# Altium schematic sheet XCF08PFS48C_FLASH.SchDoc: FPGA Config XCF08PFS48C
size A4; Organization: Altium Limited.; Address1: Level 3, 12a Rodborough Rd; Address2: Frenchs Forest 2086; Address3: NSW; Address4: AUSTRALIA; SheetNumber: 1; SheetTotal: 100; PageSetup: Record=PageOptions|CenterHorizontal=True|CenterVertical=True|PrintScale=0.75|XCorrection=1.00|YCorrection=1.00|PrintKind=0|BorderSize=5000000|LeftOffset=0|BottomOffset=0|Orientation=2|PaperLength=1000|PaperWidth=1000|Scale=100|PaperSource=7|PrintQuality=-4|MediaType=1|DitherType=10|PaperKind=A4 (210 x 297mm)|PrintScaleMode=1
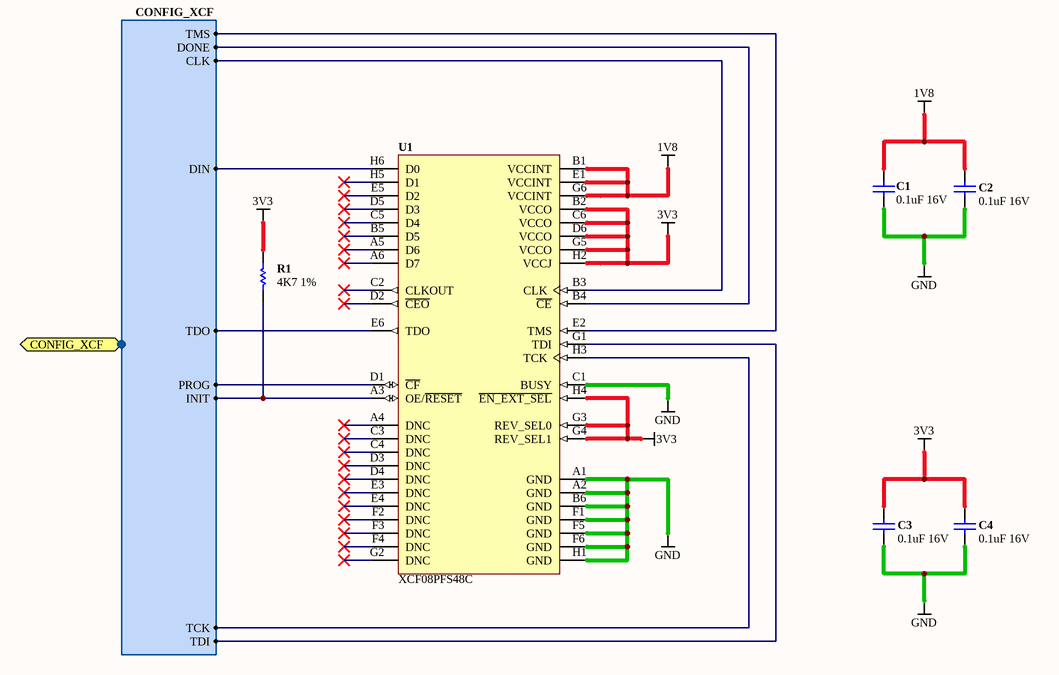
[diagram p0: XCF08PFS48C_FLASH.SchDoc]

## Parts
C1  0.1uF 16V  [CAPC1005-STAR]
C2  0.1uF 16V  [CAPC1005-STAR]
C3  0.1uF 16V  [CAPC1005-STAR]
C4  0.1uF 16V  [CAPC1005-STAR]
R1  4K7 1%  [RESC1005-STAR]
U1  XCF08PFS48C  [BGA80P8X6-48]

## Ports
CONFIG_XCF (harness CONFIG_XCF)

## Harnesses
CONFIG_XCF: DONE, CLK, TMS, DIN, TDO, PROG, INIT, TCK, TDI

## Nets
1V8: C1.2 C2.1 U1.B1(VCCINT) U1.E1(VCCINT) U1.G6(VCCINT)
3V3: C3.1 C4.1 R1.1 U1.B2(VCCO) U1.C6(VCCO) U1.D6(VCCO) U1.G3(REV_SEL0) U1.G4(REV_SEL1) U1.G5(VCCO) U1.H2(VCCJ) U1.H4(~{EN_EXT_SEL})
GND: C1.1 C2.2 C3.2 C4.2 U1.A1(GND) U1.A2(GND) U1.B6(GND) U1.C1(BUSY) U1.F1(GND) U1.F5(GND) U1.F6(GND) U1.H1(GND)
NetR1_2: R1.2 U1.A3(OE/~{RESET}) ; port CONFIG_XCF.INIT
NetU1_B3: U1.B3(CLK) ; port CONFIG_XCF.CLK
NetU1_B4: U1.B4(~{CE}) ; port CONFIG_XCF.DONE
NetU1_D1: U1.D1(~{CF}) ; port CONFIG_XCF.PROG
NetU1_E2: U1.E2(TMS) ; port CONFIG_XCF.TMS
NetU1_E6: U1.E6(TDO) ; port CONFIG_XCF.TDO
NetU1_G1: U1.G1(TDI) ; port CONFIG_XCF.TDI
NetU1_H3: U1.H3(TCK) ; port CONFIG_XCF.TCK
NetU1_H6: U1.H6(D0) ; port CONFIG_XCF.DIN

Not connected (* = marked no-connect by the designer): U1 A4(DNC)* A5(D6)* A6(D7)* B5(D5)* C2(CLKOUT)* C3(DNC)* C4(DNC)* C5(D4)* D2(~{CEO})* D3(DNC)* D4(DNC)* D5(D3)* E3(DNC)* E4(DNC)* E5(D2)* F2(DNC)* F3(DNC)* F4(DNC)* G2(DNC)* H5(D1)*

## Notes on the sheet
- Sheet Title
- Project Title
- Size:
- Date:
- A4
- Assy:
- Time:
- Revision:
- Sheet
- of
- File:

## Library data of the parts
C1-C4 = D-101-0080: Capacitor, Ceramic, 0.1uF 10% 16V 0402 (1005) X7R; Polarity: Non-Polarized; Category: Capacitor; Capacitance: 0.1 uF; Dielectric: X7R; Mounting Technology: Surface Mount; Rated Voltage: 16 V; Status: Production; Technology: Ceramic; Tolerance: 10 %
R1 = D-100-0088: Resistor, 4K7 1% 0402 (1005); Power Rating: 63 mW; Resistance: 4.7 K; Category: Resistor; Mounting Technology: Surface Mount; Status: Production; Tolerance: 1 %
U1 = D-262-0000: XCF00P Series, Platform Flash In-System Programmable Configuration 1.8V PROM, 48 Ball BGA, 8-Megabit, Commercial Grade; Category: IC-Flash; Status: Production